# Altium schematic sheet AUDIO CODEC.SchDoc: AUDIO CODEC
size A4; DocumentNumber: 5; Revision: 2.0; SheetNumber: 5; SheetTotal: 18
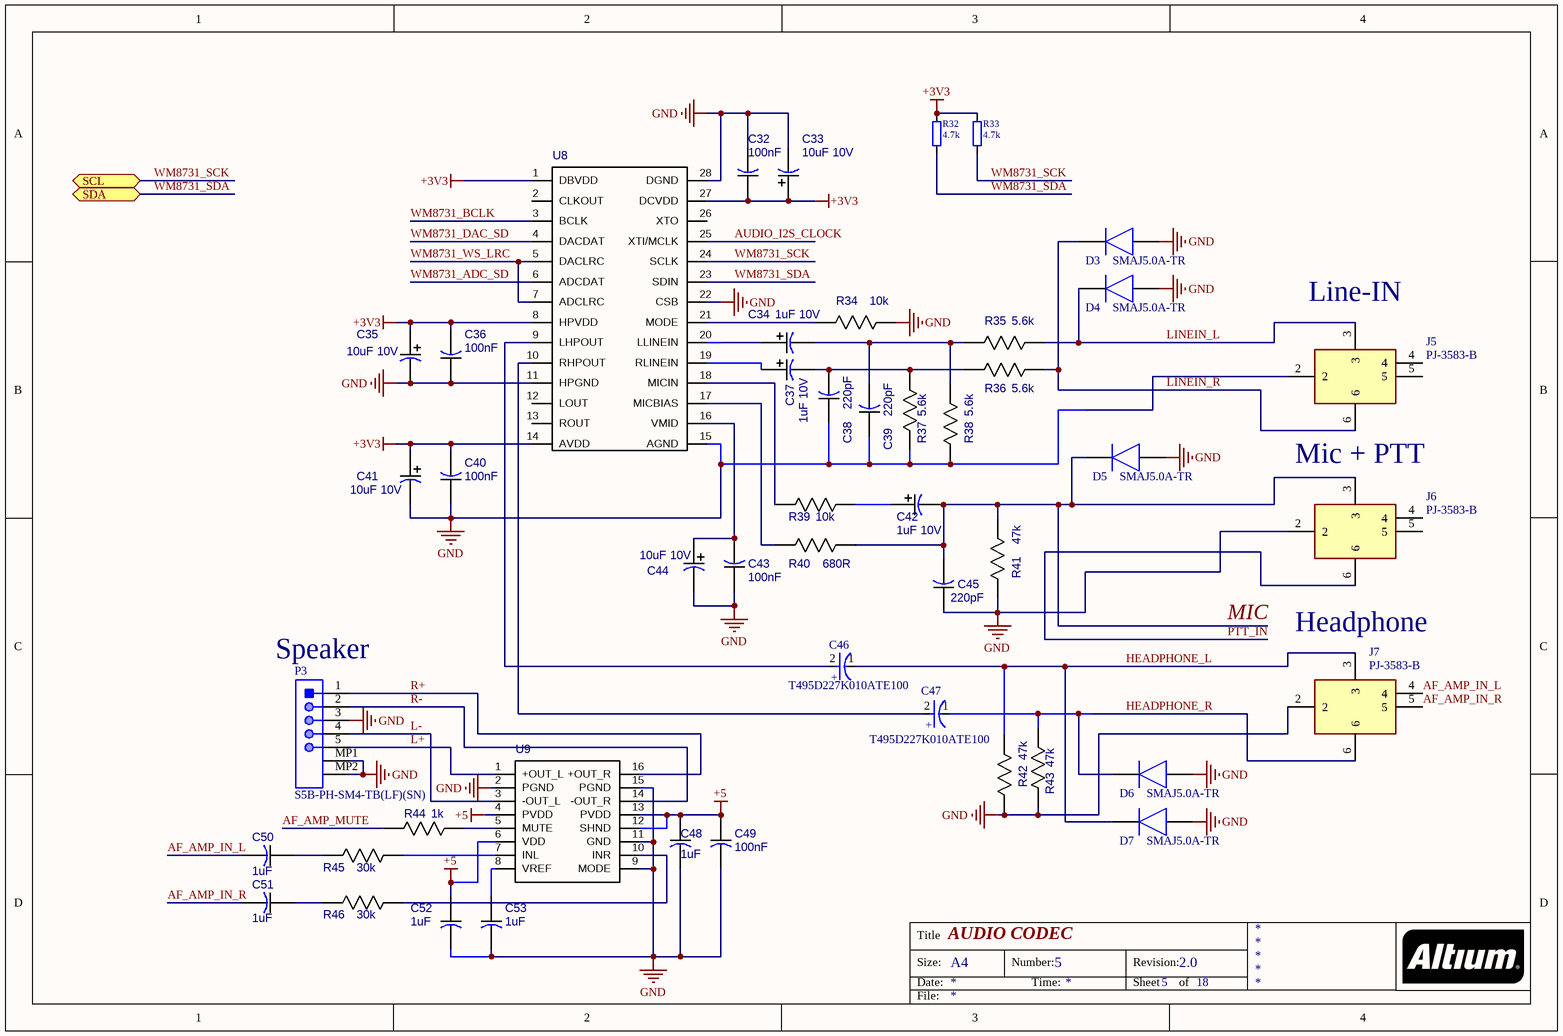
[diagram p0: AUDIO CODEC.SchDoc]

## Parts
C32  100nF  [CAP_0805]
C33  10uF 10V  [CAPAE_4.3x4.3h5.4]
C34  1uF 10V  [CAPAE_4.3x4.3h5.4]
C35  10uF 10V  [CAPAE_4.3x4.3h5.4]
C36  100nF  [CAP_0805]
C37  1uF 10V  [CAPAE_4.3x4.3h5.4]
C38  220pF  [CAP_0805]
C39  220pF  [CAP_0805]
C40  100nF  [CAP_0805]
C41  10uF 10V  [CAPAE_4.3x4.3h5.4]
C42  1uF 10V  [CAPAE_4.3x4.3h5.4]
C43  100nF  [CAP_0805]
C44  10uF 10V  [CAPAE_4.3x4.3h5.4]
C45  220pF  [CAP_0805]
C46  T495D227K010ATE100  [FP-T495D227K010ATE100-MFG]
C47  T495D227K010ATE100  [FP-T495D227K010ATE100-MFG]
C48  1uF  [CAP_0805]
C49  100nF  [CAP_0805]
C50  1uF  [CAP_0805]
C51  1uF  [CAP_0805]
C52  1uF  [CAP_0805]
C53  1uF  [CAP_0805]
D3  SMAJ5.0A-TR  [SMBJ36CATR]
D4  SMAJ5.0A-TR  [SMBJ36CATR]
D5  SMAJ5.0A-TR  [SMBJ36CATR]
D6  SMAJ5.0A-TR  [SMBJ36CATR]
D7  SMAJ5.0A-TR  [SMBJ36CATR]
J5  PJ-3583-B  [PJ3583B]
J6  PJ-3583-B  [PJ3583B]
J7  PJ-3583-B  [PJ3583B]
P3  S5B-PH-SM4-TB(LF)(SN)  [JST-S5B-PH-SM4-TB_V]
R32  4.7k  [R-0805]
R33  4.7k  [R-0805]
R34  10k  [RES_0805]
R35  5.6k  [RES_0805]
R36  5.6k  [RES_0805]
R37  5.6k  [RES_0805]
R38  5.6k  [RES_0805]
R39  10k  [RES_0805]
R40  680R  [RES_0805]
R41  47k  [RES_0805]
R42  47k  [RES_0805]
R43  47k  [RES_0805]
R44  1k  [RES_0805]
R45  30k  [RES_0805]
R46  30k  [RES_0805]
U8  WM8731  [WM8731]  (value not drawn)
U9  PAM8406  [PAM8403]  (value not drawn)

## Ports
SCL (bidir), SDA (bidir)

## Nets
+3V3: C32.1 C33.1(PLUS) C35.1(PLUS) C36.2 C40.2 C41.1(PLUS) R32.2 R33.2 U8.1(DBVDD) U8.8(HPVDD) U8.14(AVDD) U8.27(DCVDD)
+5: C48.1 C49.1 C52.1 U9.4(PVDD) U9.6(VDD) U9.12(SHND) U9.13(PVDD)
GND: C32.2 C33.2(MINUS) C35.2(MINUS) C36.1 C38.1 C39.1 C40.1 C41.2(MINUS) C43.1 C44.2(MINUS) C45.1 C48.2 C49.2 C52.2 C53.2 D3.2(A) D4.2(A) D5.2(A) D6.2(A) D7.2(A) J5.2 J6.2 J7.2 P3.3 P3.MP1 P3.MP2 R34.1 R37.1 R38.1 R41.1 R42.1 R43.1 U8.11(HPGND) U8.15(AGND) U8.22(CSB) U8.28(DGND) U9.2(PGND) U9.9(MODE) U9.11(GND) U9.15(PGND)
AF_AMP_IN_L: C50.2 J7.4
AF_AMP_IN_R: C51.2 J7.5
AF_AMP_MUTE: R44.2
AUDIO_I2S_CLOCK: U8.25(XTI/MCLK)
HEADPHONE_L: C46.1(C) D7.1(K) J7.3 R42.2
HEADPHONE_R: C47.1(C) D6.1(K) J7.6 R43.2
L+: P3.5 U9.1(+OUT_L)
L-: P3.4 U9.3(-OUT_L)
LINEIN_L: D4.1(K) J5.3 R35.1
LINEIN_R: D3.1(K) J5.6 R36.1
MIC: C42.2(MINUS) C45.2 D5.1(K) J6.3 R40.1 R41.2
PTT_IN: J6.6
R+: P3.1 U9.16(+OUT_R)
R-: P3.2 U9.14(-OUT_R)
WM8731_ADC_SD: U8.6(ADCDAT)
WM8731_BCLK: U8.3(BCLK)
WM8731_DAC_SD: U8.4(DACDAT)
WM8731_SCK: R33.1 U8.24(SCLK) ; port SCL
WM8731_SDA: R32.1 U8.23(SDIN) ; port SDA
WM8731_WS_LRC: U8.5(DACLRC) U8.7(ADCLRC)
NetC34_1: C34.1(PLUS) U8.20(LLINEIN)
NetC34_2: C34.2(MINUS) C39.2 R35.2 R38.2
NetC37_1: C37.1(PLUS) U8.19(RLINEIN)
NetC37_2: C37.2(MINUS) C38.2 R36.2 R37.2
NetC42_1: C42.1(PLUS) R39.1
NetC43_2: C43.2 C44.1(PLUS) U8.16(VMID)
NetC46_2: C46.2(A) U8.9(LHPOUT)
NetC47_2: C47.2(A) U8.10(RHPOUT)
NetC50_1: C50.1 R45.2
NetC51_1: C51.1 R46.2
NetC53_1: C53.1 U9.8(VREF)
NetR34_2: R34.2 U8.21(MODE)
NetR39_2: R39.2 U8.18(MICIN)
NetR40_2: R40.2 U8.17(MICBIAS)
NetR44_1: R44.1 U9.5(MUTE)
NetR45_1: R45.1 U9.7(INL)
NetR46_1: R46.1 U9.10(INR)

Not connected (* = marked no-connect by the designer): J5 4 5; J6 4 5; U8 2(CLKOUT) 12(LOUT) 13(ROUT) 26(XTO)

## Notes on the sheet
- (near J5) Line-IN
- Mic + PTT
- Headphone
- (near P3) Speaker
- Title
- Size:
- Date:
- A4
- Number:
- Time:
- Revision:
- Sheet
- of
- File:
- (in symbol CMP-03017-000025-1) +

## Library data of the parts
C32 C36 C38-C40 C43 C45 C48-C53 = CAP_0805
  C32 C36 C40 C43 C49: Value: 100nF
  C38 C39 C45: Value: 220pF
  C48 C50-C52: Value: 1uF
C33-C35 C37 C41 C42 C44 = CAPAE_4.3x4.3h5.4
  C33 C35 C41 C44: Value: 10uF 10V
  C34 C37 C42: Value: 1uF 10V
C46 C47 = CMP-03017-000025-1: CAP TANT 220UF 10% 10V 2917; Life (Hours): 2000Hour; Dielectric Material: Tantalum; Ripple Current: 1.225A; Dissipation Factor: 8%; ESR (Equivalent Series Resistance): 100mR; Leakage Current: 22uA; Polarity: Polar; Max Operating Temperature: 125°C; Features: General Purpose; Voltage Rating: 10V; Depth: 4.3mm; Case Code (Imperial): 2917; Length: 7.3mm; Package Quantity: 1; Mount: Surface Mount; Min Operating Temperature: -55°C; Termination: SMD/SMT; Voltage Rating (DC): 10V; Height: 2.8mm; Construction: Flat; Case Code (Metric): 7343; Radiation Hardening: No; Number of Pins: 2; Series: T495; Tolerance: 10%; Capacitance: 220uF; Case/Package: 2917; Lead Pitch: 3.8mm; RoHS Compliant: Yes; Width: 0.169inch; Packaging: Tape and Reel; Voltage: 10V; Height - Seated (Max): 0.122inch; REACH SVHC: No SVHC
D3-D7 = SMLVT3V3: Diode; Manufacturer_Name: STMicroelectronics; Allied_Number: 70013736; Datasheet Link: http://www.st.com/web/en/resource/technical/document/datasheet/CD00000923.pdf; Height: 2.65mm; Manufacturer_Part_Number: SMLVT3V3; Mouser Part Number: 511-SMLVT3V3; Mouser Price/Stock: https://www.mouser.com/Search/Refine.aspx?Keyword=511-SMLVT3V3; RS Part Number: 5444821P; RS Price/Stock: http://uk.rs-online.com/web/p/products/5444821P; Allied Price/Stock: http://www.alliedelec.com/stmicroelectronics-smlvt3v3/70013736/
J5-J7 = PJ-3583-B: Connector; Manufacturer_Name: JJ Electronics; Datasheet Link: https://datasheet.lcsc.com/szlcsc/2002271836_XKB-Enterprise-PJ-3583-B_C397337.pdf; Height: 15mm; Manufacturer_Part_Number: PJ-3583-B
P3 = CMP-2000-07026-1: Male Header, Pitch 2 mm, 1 x 5 Position, Height 5.5 mm, -25 to 85 degC, RoHS, Tape and Reel; Manufacturer: JST; No of Positions: 5; Pitch: 2mm; Style/Orientation: RightAngleHeader/Plug; Manufacturer URL: http://www.jst.com/home2.html; Datasheet URL: http://www.jst-mfg.com/product/pdf/eng/ePH.pdf; Termination: Crimp; Mounting Technology: SurfaceMount; Package Reference: S5B-PH-SM4-TB; Type: WiretoBoard; Datasheet Version: 12/2012; Package Description: Male Header, Pitch 2 mm, 1 x 5 Position, Height 5.5 mm
R32 R33 = RES semi: Chip Resistor; Manufacturer: Yageo/Phycomp; Manufacturer P/N: RC0603FR-0749R9L; numsch: 021; TypeNum: 212; Parameters: 49.9R, RC, 0.1W, ±1%, TCR ±100ppm; Power: *; TCR: *; Series: *; Tolerance: *
R34-R46 = RES_0805
  R34 R39: Value: 10k
  R35-R38: Value: 5.6k
  R40: Value: 680R
  R41-R43: Value: 47k
U8 = WM8731: Value: *
U9 = PAM8406: Value: *